# Altium schematic sheet Zegar_schemmatic.SchDoc
size A4; SheetNumber: 1; SheetTotal: 1
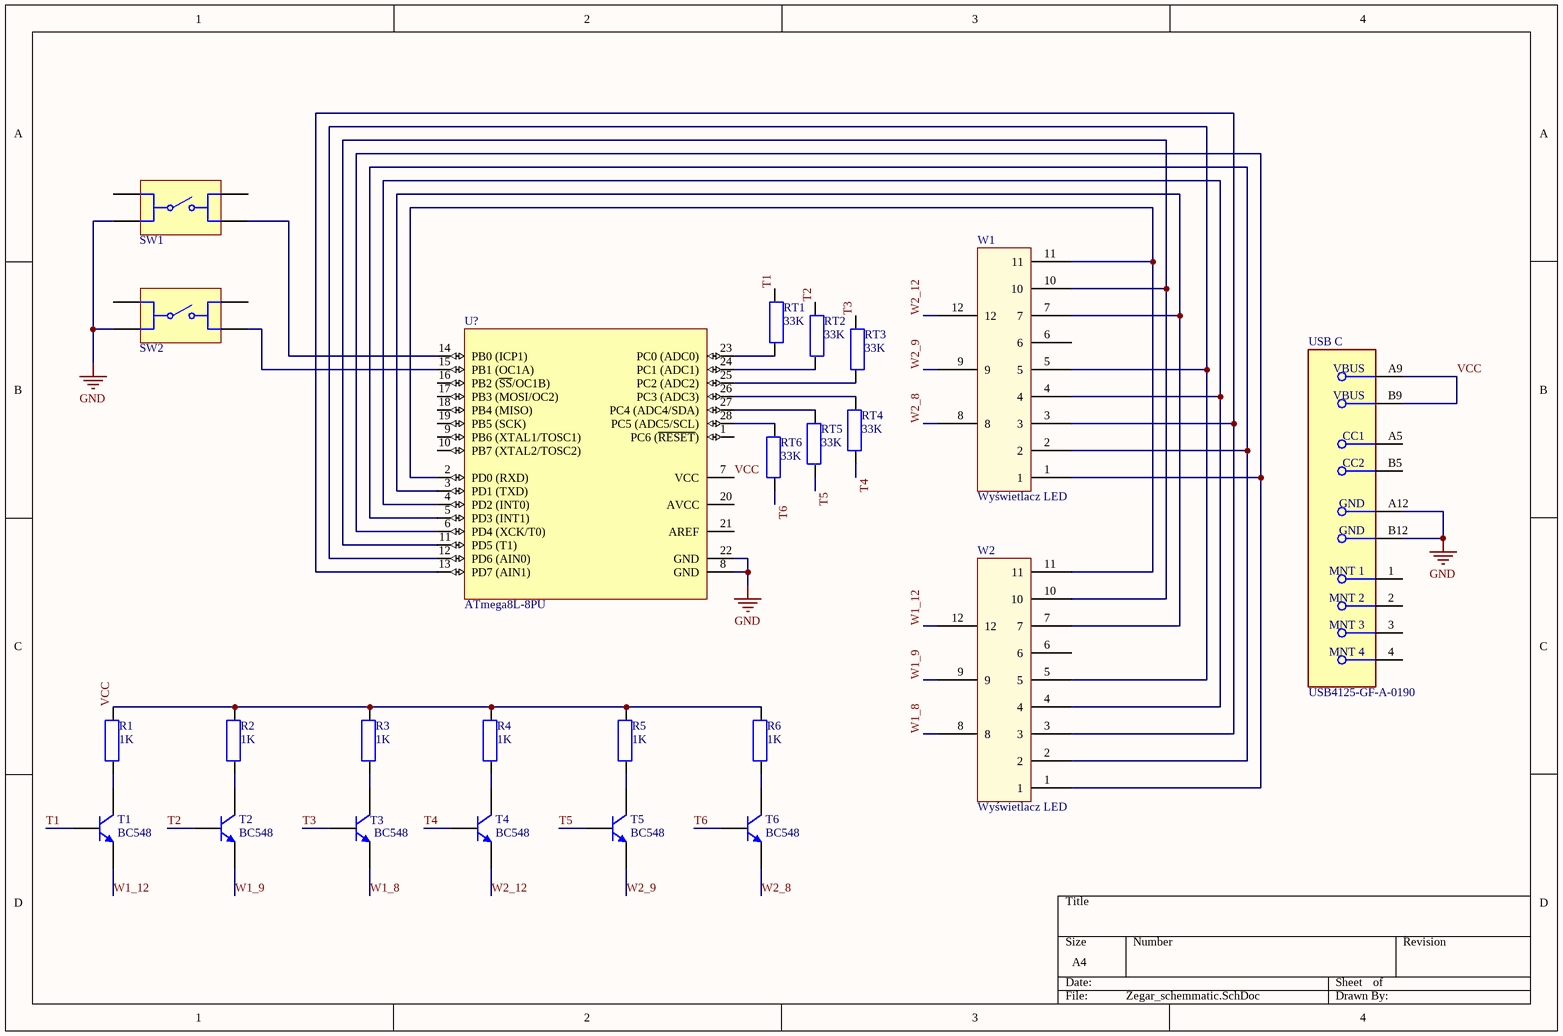
[diagram p0: Zegar_schemmatic.SchDoc]

## Parts
R1  value 1K  [AX_1/4W_4M]  (hidden comment: RES_AX_1/4W_4M)
R2  value 1K  [AX_1/4W_4M]  (hidden comment: RES_AX_1/4W_4M)
R3  value 1K  [AX_1/4W_4M]  (hidden comment: RES_AX_1/4W_4M)
R4  value 1K  [AX_1/4W_4M]  (hidden comment: RES_AX_1/4W_4M)
R5  value 1K  [AX_1/4W_4M]  (hidden comment: RES_AX_1/4W_4M)
R6  value 1K  [AX_1/4W_4M]  (hidden comment: RES_AX_1/4W_4M)
RT1  value 33K  [AX_1/4W_4M]  (hidden comment: RES_AX_1/4W_4M)
RT2  value 33K  [AX_1/4W_4M]  (hidden comment: RES_AX_1/4W_4M)
RT3  value 33K  [AX_1/4W_4M]  (hidden comment: RES_AX_1/4W_4M)
RT4  value 33K  [AX_1/4W_4M]  (hidden comment: RES_AX_1/4W_4M)
RT5  value 33K  [AX_1/4W_4M]  (hidden comment: RES_AX_1/4W_4M)
RT6  value 33K  [AX_1/4W_4M]  (hidden comment: RES_AX_1/4W_4M)
SW1  SWITCH_SQ_6m_4X6m  [SQ_6m_4X6m]  (value not drawn)
SW2  SWITCH_SQ_6m_4X6m  [SQ_6m_4X6m]  (value not drawn)
T1  BC548  [TO-92W]
T2  BC548  [TO-92W]
T3  BC548  [TO-92W]
T4  BC548  [TO-92W]
T5  BC548  [TO-92W]
T6  BC548  [TO-92W]
U?  ATmega8L-8PU  [28P3]
USB_C  USB4125-GF-A-0190  [FP-USB4125-GF-A-0190-MFG]
W1  Wyświetlacz LED  [PCBComponent_1]
W2  Wyświetlacz LED  [PCBComponent_1]

## Nets
GND: SW1.2 SW2.2 U?.8(GND) U?.22(GND) USB_C.A12(GND) USB_C.B12(GND)
T1: RT1.1 T1.2(B)
T2: RT2.1 T2.2(B)
T3: RT3.1 T3.2(B)
T4: RT4.1 T4.2(B)
T5: RT5.1 T5.2(B)
T6: RT6.1 T6.2(B)
VCC: R1.2 R2.2 R3.2 R4.2 R5.2 R6.2 U?.7(VCC) USB_C.A9(VBUS) USB_C.B9(VBUS)
W1_8: T3.3(E) W2.8
W1_9: T2.3(E) W2.9
W1_12: T1.3(E) W2.12
W2_8: T6.3(E) W1.8
W2_9: T5.3(E) W1.9
W2_12: T4.3(E) W1.12
NetR1_1: R1.1 T1.1(C)
NetR2_1: R2.1 T2.1(C)
NetR3_1: R3.1 T3.1(C)
NetR4_1: R4.1 T4.1(C)
NetR5_1: R5.1 T5.1(C)
NetR6_1: R6.1 T6.1(C)
NetRT1_2: RT1.2 U?.23(PC0_(ADC0))
NetRT2_2: RT2.2 U?.24(PC1_(ADC1))
NetRT3_2: RT3.2 U?.25(PC2_(ADC2))
NetRT4_2: RT4.2 U?.26(PC3_(ADC3))
NetRT5_2: RT5.2 U?.27(PC4_(ADC4/SDA))
NetRT6_2: RT6.2 U?.28(PC5_(ADC5/SCL))
NetSW1_3: SW1.3 U?.14(PB0_(ICP1))
NetSW2_3: SW2.3 U?.15(PB1_(OC1A))
NetU?_2: U?.2(PD0_(RXD)) W1.11 W2.11
NetU?_3: U?.3(PD1_(TXD)) W1.7 W2.7
NetU?_4: U?.4(PD2_(INT0)) W1.4 W2.4
NetU?_5: U?.5(PD3_(INT1)) W1.2 W2.2
NetU?_6: U?.6(PD4_(XCK/T0)) W1.1 W2.1
NetU?_11: U?.11(PD5_(T1)) W1.10 W2.10
NetU?_12: U?.12(PD6_(AIN0)) W1.5 W2.5
NetU?_13: U?.13(PD7_(AIN1)) W1.3 W2.3

Not connected (* = marked no-connect by the designer): SW1 1 4; SW2 1 4; U? 1(PC6_(~{RESET})) 9(PB6_(XTAL1/TOSC1)) 10(PB7_(XTAL2/TOSC2)) 16(PB2_(~{SS}/OC1B)) 17(PB3_(MOSI/OC2)) 18(PB4_(MISO)) 19(PB5_(SCK)) 20(AVCC) 21(AREF); USB_C 1(MNT_1) 2(MNT_2) 3(MNT_3) 4(MNT_4) A5(CC1) B5(CC2); W1 6; W2 6

## Library data of the parts
R1-R6 RT1-RT6 = RES_AX_1/4W_4M: Resistor; Published: 8-Jun-2000; LatestRevisionDate: 17-Jul-2002; LatestRevisionNote: Re-released for DXP Platform.; PackageReference: AXIAL-0.4; Publisher: Altium Limited; PackageDescription: Axial Device, Thru-Hole; 2 Leads; 0.4 in Pin Spacing
SW1 SW2 = SWITCH_SQ_6m_4X6m: Actuator Length: 1.5mm; Switch Function: Off-Mom; Voltage Rating: 12V; Current Rating: 50mA; Height: 4mm; Mount: Through Hole; Contact Current Rating: 50mA
T1-T6 = BC548: Amplifier Transistor, NPN Silicon, 3-Pin TO-92, Bulk Box; Manufacturer: On Semiconductor; PartNumber: BC548B; IC Continuous (A): 0.1; fT Min (MHz): 150; Mounting Technology: Through Hole; ComponentLink3Description: Package Specification; Polarity: NPN; ComponentLink3URL: http://www.onsemi.cn/pub_link/Collateral/2N6426-D.PDF; ComponentLink2Description: Datasheet; ComponentLink1Description: Manufacturer URL; ComponentLink2URL: http://www.onsemi.com/pub_link/Collateral/BC546-D.PDF; PackageReference: TO-92-3-29-11_AM_SL; DatasheetVersion: Rev. 7; PackageDescription: 3-Pin Transistor Outline, Body 4.825 x 3.685 mm, Pitch 1.27 mm; PackageVersion: Rev. AM; Packing: Bulk Box; RoHS: FALSE; ComponentLink1URL: http://www.onsemi.com/
U? = CMP-0095-00374-1: 8-bit AVR Microcontroller, 2.7-5.5V, 8MHz, 8KB Flash, 512 Bytes EEPROM, 1KB SRAM, 28-pin PDIP, Industrial Grade (-40°C to 85°C); ComponentLink2URL: http://www.atmel.com/dyn/resources/prod_documents/doc2486.pdf; PackageDescription: 28-lead (0.300"/7.62mm Wide) Plastic Dual Inline Package (PDIP); ComponentLink1URL: http://www.atmel.com/; DatasheetVersion: revZ, Feb-2011; ComponentLink3URL: http://www.atmel.com/dyn/resources/prod_documents/2486S.pdf; PackageVersion: revB, Sep-2001; ComponentLink3Description: ATmega8(L) Summary; PackageReference: 28P3; ComponentLink2Description: ATmega8(L); ComponentLink1Description: Manufacturer URL
USB_C = CMP-245163-000004-1: CONN RCPT TYPE C 6P SMD RA